# EAGLE design Tiny Programmer Level Shifter (EAGLE 7.7.0)
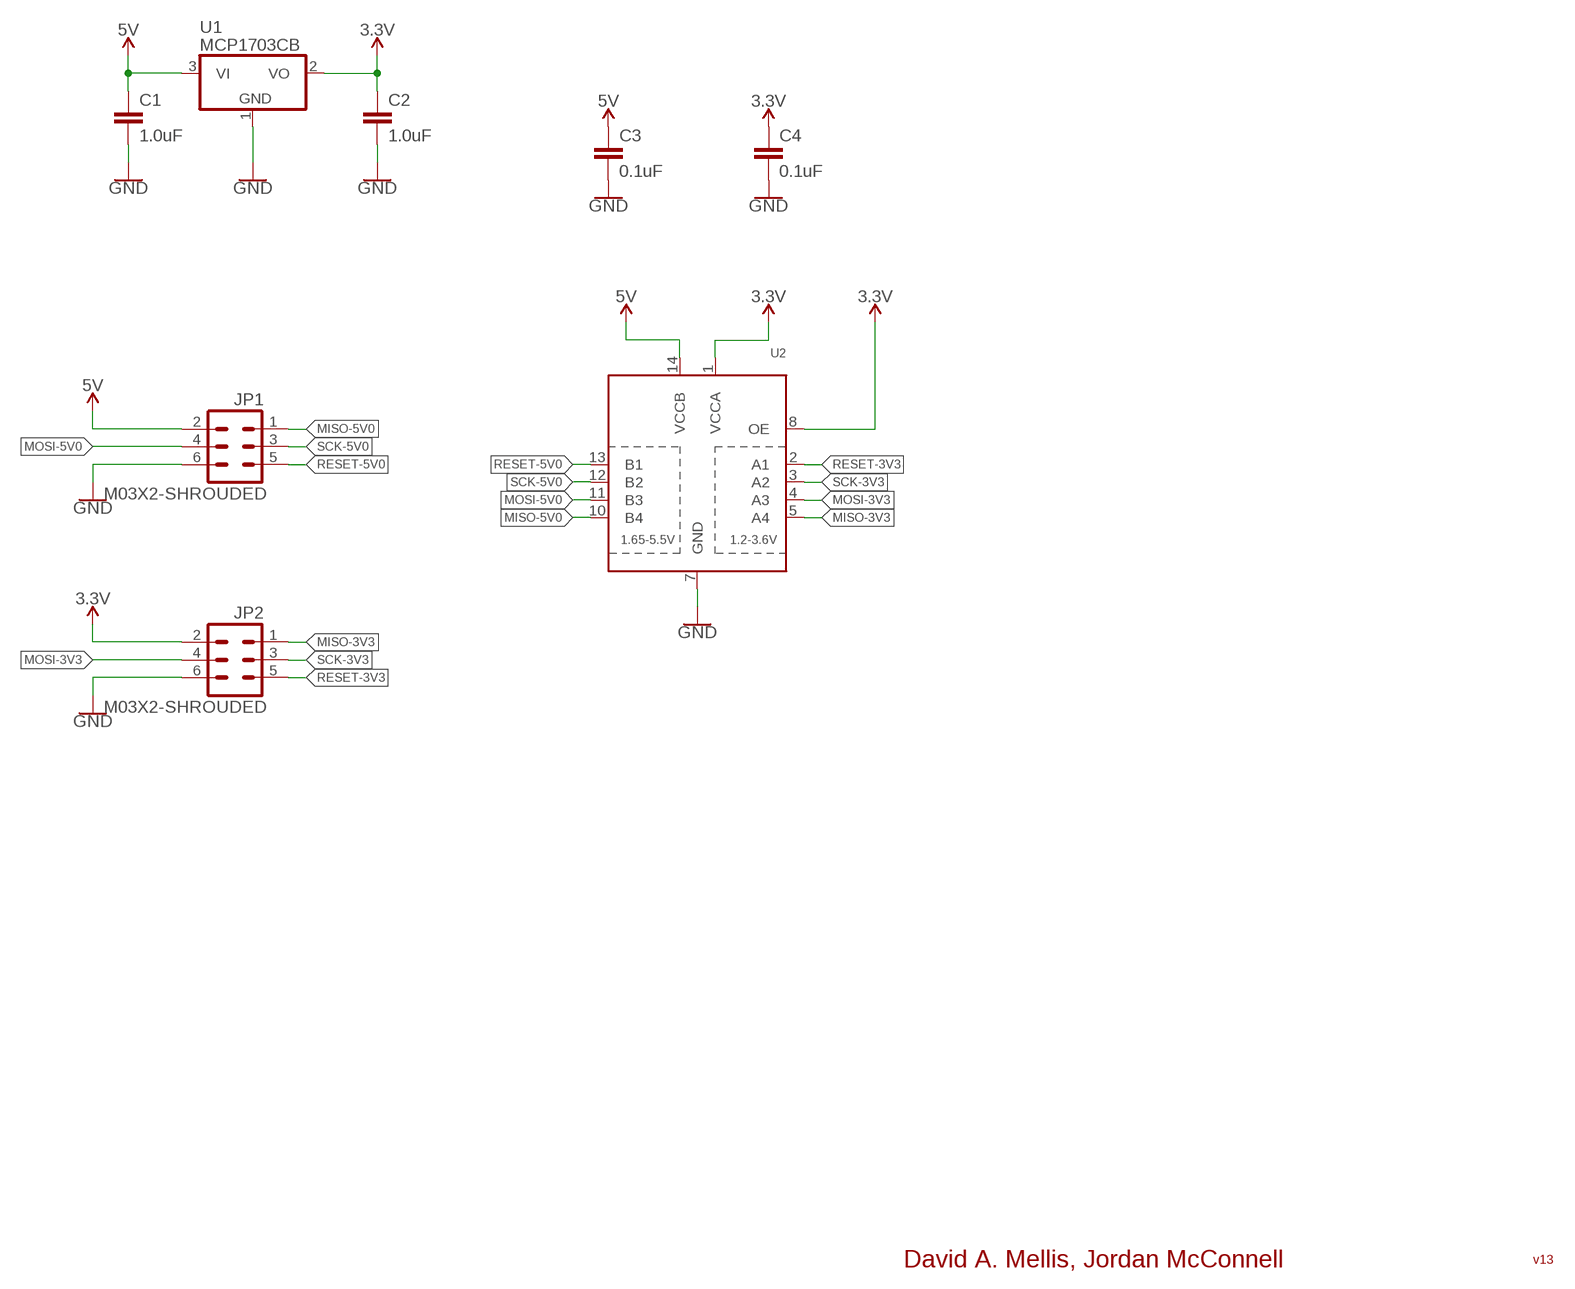
[diagram p0: schematic, sheet 1]

## Parts
C1  1.0uF  CAPACITOR-0603  [0603-CAP]
C2  1.0uF  CAPACITOR-0603  [0603-CAP]
C3  0.1uF  CAPACITOR-0603  [0603-CAP]
C4  0.1uF  CAPACITOR-0603  [0603-CAP]
JP1  M03X2-SHROUDED  [2X3-SHROUDED-B]
JP2  M03X2-SHROUDED  [2X3-SHROUDED-B]
U1  MCP1703CB  [SOT23]
U2  TXB0104PWR  [TSSOP14]

## Nets
3.3V: C2.1 C4.1 JP2.2 U1.2(VO) U2.1(VCCA) U2.8(OE)
5V: C1.1 C3.1 JP1.2 U1.3(VI) U2.14(VCCB)
GND: C1.2 C2.2 C3.2 C4.2 JP1.6 JP2.6 U1.1(GND) U2.7(GND)
MISO-3V3: JP2.1 U2.5(A4)
MISO-5V0: JP1.1 U2.10(B4)
MOSI-3V3: JP2.4 U2.4(A3)
MOSI-5V0: JP1.4 U2.11(B3)
RESET-3V3: JP2.5 U2.2(A1)
RESET-5V0: JP1.5 U2.13(B1)
SCK-3V3: JP2.3 U2.3(A2)
SCK-5V0: JP1.3 U2.12(B2)

## Notes on the sheet
- v13
- David A. Mellis, Jordan McConnell

## Library data of the parts
C1-C4 = Darryl-Capacitors:CAPACITOR: Capacitor
JP1 JP2 = Darryl:M03X2
U1 = linear:MCP1703: 250 mA, 16V, Low Quiescent Current LDO Regulator Source: http://ww1.microchip.com/downloads/en/DeviceDoc/22049b.pdf
U2 = adafruit:TXB0104PWR: 4-Bit Bi-Directional Level Shifter 1.2V-3.6V (VCCA) to 1.65V-5.5V (VCCB) bi-directional level shifter with auto direction sensing. Max data rate - VCCA 1.8V: 20Mbps (50ns), VCCA 3.3V: 100Mbps (10ns) Digikey: 296-21929-1-ND

## Net classes
1 powerish: width 0.254 mm

## Board
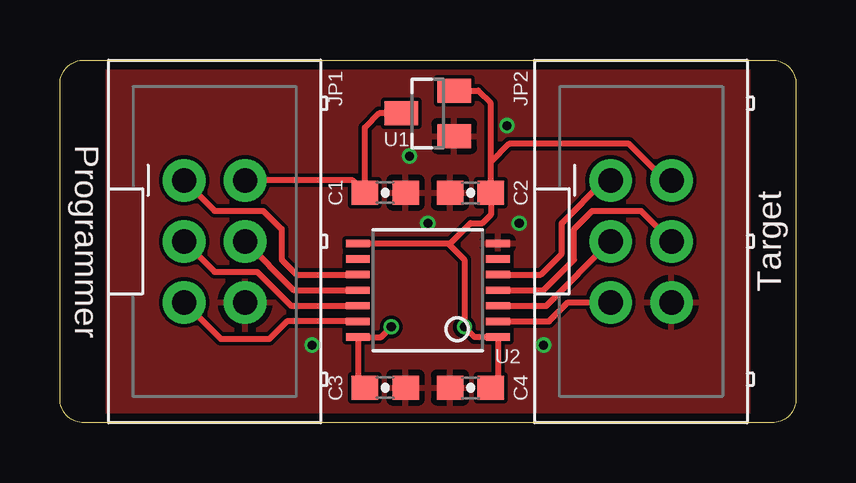
[diagram p1: board, top side]
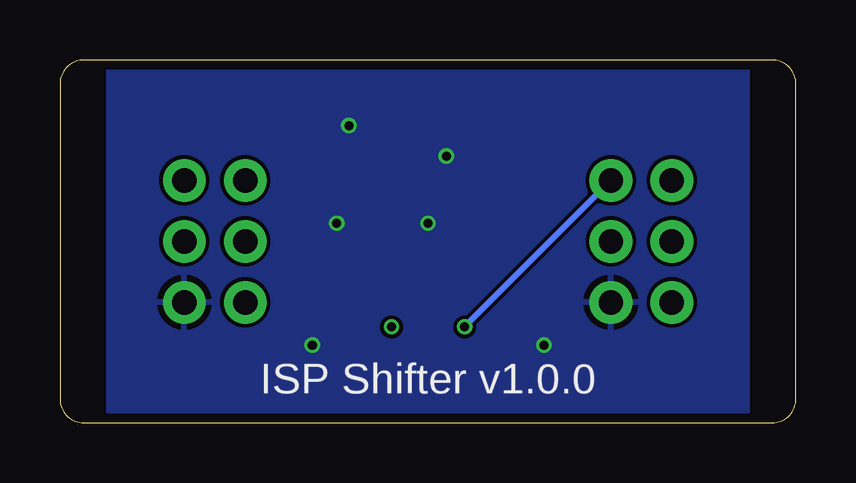
[diagram p2: board, bottom side, seen from below]

Size 30.68 x 15.12 mm. Coordinates in mm from the lower left corner, seen from the top.
Outline: 30.68,14.12 30.68,1 arc-90 29.68,0 1,0 arc-90 0,1 0,14.12 arc-90 1,15.12 29.68,15.12 arc-90 30.68,14.12
Copper layers (1*16): Top 0.035559375mm / dielectric 1.6mm / Bottom 0.035559375mm
Design rules "oshpark-2layer *": minimum track width 6mil, minimum drill 10mil, track to track 6mil, track to pad 6mil, pad to pad 6mil, via to via 6mil, smd to smd 6mil, copper to edge 15mil, drill to drill 6mil, minimum pad ring 5mil, minimum via ring 5mil, stop-mask expansion 2.5mil, vias tented up to drill 20mil, thermal gap 10mil

### Footprints (pad centres in the part's own frame; a part is rotated, then mirrored left to right if it is on the bottom)
0603-CAP = smd 1.1 x 1: 1 -0.85,0; 2 0.85,0
2X3-SHROUDED-B = drill 1.016 pad 1.778: 1 -2.54,-1.27; 2 -2.54,1.27; 3 0,-1.27; 4 0,1.27; 5 2.54,-1.27; 6 2.54,1.27
SOT23 = smd 1 x 1.4: 1 -0.95,-1.1; 2 0.95,-1.1; 3 0,1.1
TSSOP14 = smd 0.305 x 0.991: 1 -1.95,-2.918; 2 -1.3,-2.918; 3 -0.65,-2.918; 4 0,-2.918; 5 0.65,-2.918; 6 1.3,-2.918; 7 1.95,-2.918; 8 1.95,2.918; 9 1.3,2.918; 10 0.65,2.918; 11 0,2.918; 12 -0.65,2.918; 13 -1.3,2.918; 14 -1.95,2.918

### Placement (x,y rotation side)
C1  13.56,9.59 0 top
C2  17.11,9.59 180 top
C3  13.56,1.46 0 top
C4  17.11,1.46 180 top
JP1  6.45,7.56 270 top
JP2  24.23,7.56 270 top
U1  15.34,12.89 90 top
U2  15.34,5.53 90 top

### Tracks (layer width: path | path; a pad name or v marks a point on that pad's centre or on a via)
3.3V  (via drill 0.38)
  Top 0.254: U1.2 17.44,13.84 17.96,13.31 17.96,10.86 | 17.96,10.86 C2.1 17.96,8.66 17.62,8.32 17.11,8.32 16.27,7.48 16.18,7.48 | JP2.2 25.24,10.1 23.72,11.62 18.73,11.62 17.96,10.86 | C4.1 18.26,1.75 U2.1 17.29,3.58 v16.86,4 16.86,6.8 16.18,7.48 | U2.8 16.18,7.48
5V  (via drill 0.38)
  Top 0.254: JP1.2 12.2,10.1 C1.1 12.71,12.3 13.3,12.89 U1.3 | C3.1 12.42,1.75 U2.14 13.39,3.58 v13.81,4
  Bottom 0.254: v13.81,4 JP1.2
GND  (via drill 0.38)
  other vias: 15.34,8.32 19.15,8.32 14.57,11.12 18.64,12.39 20.16,3.24 10.51,3.24
  pour Bottom: 2.03,15.12 28.65,15.12 28.65,0 2.03,0
  pour Top: 2.03,15.12 28.65,15.12 28.65,0 2.03,0
MISO-3V3
  Top 0.254: U2.5 20.05,6.18 20.93,7.05 20.93,8.32 22.7,10.1 JP2.1
MISO-5V0
  Top 0.254: JP1.1 6.45,8.83 8.48,8.83 9.24,8.07 9.24,6.8 9.86,6.18 U2.10
MOSI-3V3
  Top 0.254: U2.4 20.16,5.53 21.43,6.8 21.43,8.07 22.2,8.83 24.23,8.83 JP2.4
MOSI-5V0
  Top 0.254: JP1.4 9.75,5.53 U2.11
RESET-3V3
  Top 0.254: U2.2 20.39,4.23 21.18,5.02 JP2.5
RESET-5V0
  Top 0.254: JP1.5 6.7,3.5 8.73,3.5 9.46,4.23 U2.13
SCK-3V3
  Top 0.254: U2.3 20.28,4.88 JP2.3
SCK-5V0
  Top 0.254: JP1.3 6.45,6.29 8.22,6.29 9.64,4.88 U2.12

### Text on the board
bPlace: ISP Shifter v1.0.0
tNames: Programmer | Target